# EAGLE schematic uacs (EAGLE 7.1.0)

## Sheet 1 of 5: Display
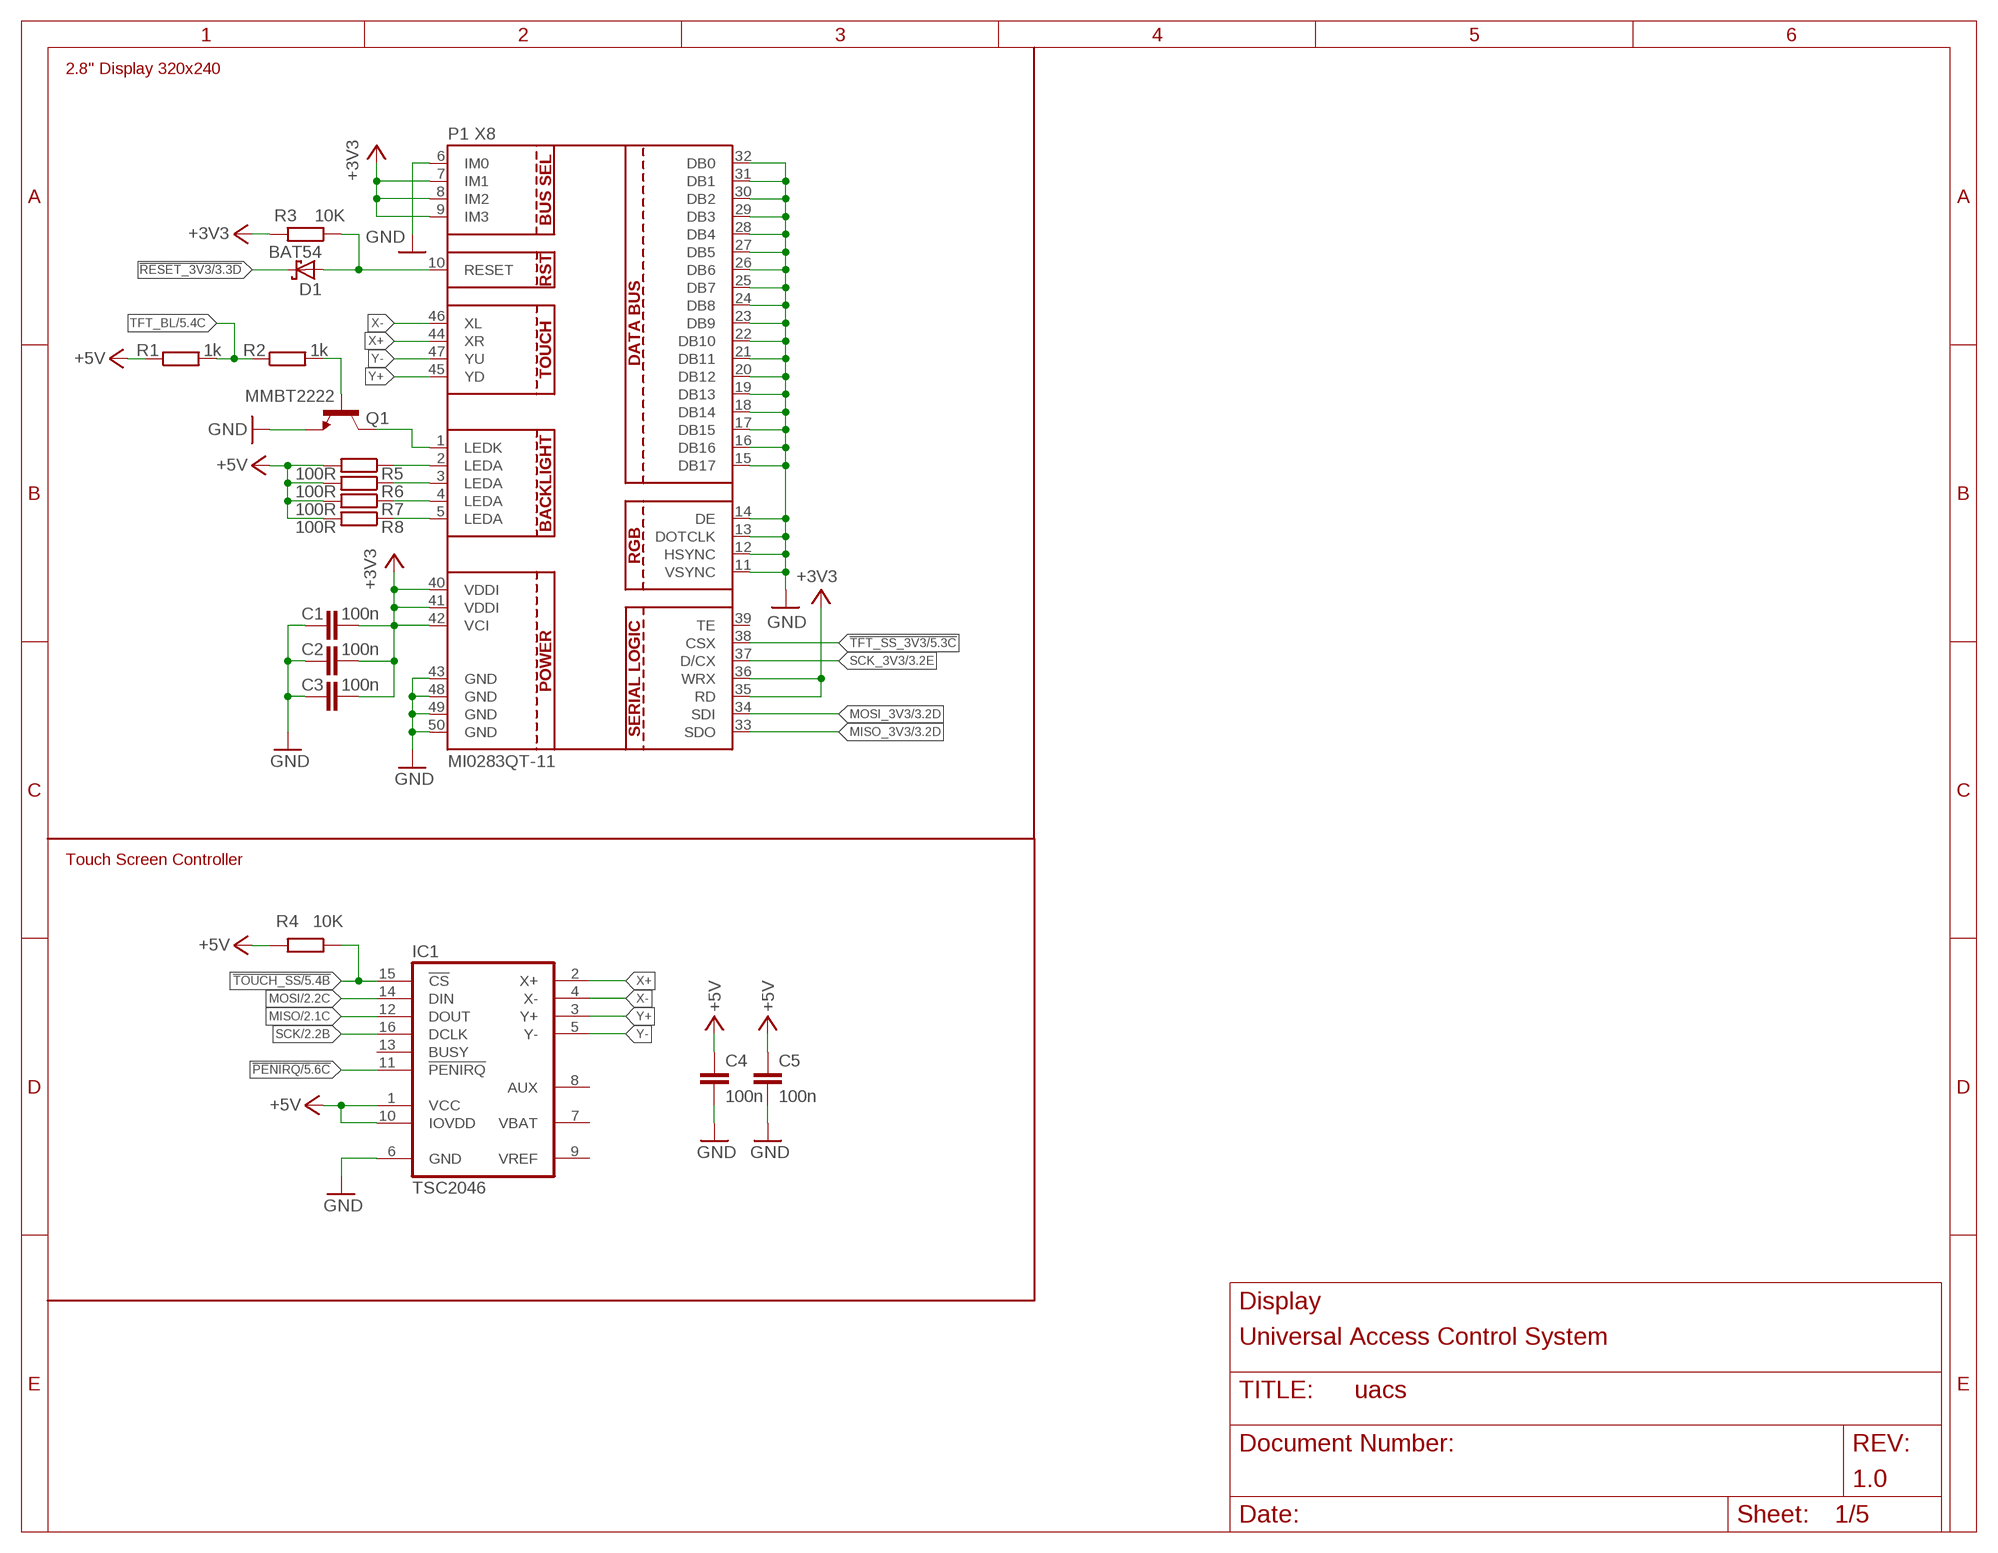
[diagram p0: schematic, sheet 1]

### Parts
C1  100n  C-EUC0603  [C0603]
C2  100n  C-EUC0603  [C0603]
C3  100n  C-EUC0603  [C0603]
C4  100n  C-EUC0603  [C0603]
C5  100n  C-EUC0603  [C0603]
D1  BAT54  [SOT23]
IC1  TSC2046  [TSSOP16]
P1  MI0283QT-11  [MI0283QT-11]
Q1  MMBT2222  TRANSISTOR_NPNMMBT2222A  [SOT23-3]
R1  1k  R-EU_R0603  [R0603]
R2  1k  R-EU_R0603  [R0603]
R3  10K  R-EU_R0603  [R0603]
R4  10K  R-EU_R0603  [R0603]
R5  100R  R-EU_R0603  [R0603]
R6  100R  R-EU_R0603  [R0603]
R7  100R  R-EU_R0603  [R0603]
R8  100R  R-EU_R0603  [R0603]

### Nets
!PENIRQ: IC1.11(!PENIRQ) ; also sheet 5
!RESET_3V3: D1.3(C) ; also sheet 3,5
!TFT_SS_3V3: P1.38(CSX) ; also sheet 5
!TOUCH_SS: IC1.15(!CS) R4.1 ; also sheet 5
+3V3: C1.2 C2.2 C3.2 P1.7(IM1) P1.8(IM2) P1.9(IM3) P1.35(RD) P1.36(WRX) P1.40(VDDI) P1.41(VDDI) P1.42(VCI) R3.2 ; also sheet 3,4,5
+5V: C4.1 C5.1 IC1.1(VCC) IC1.10(IOVDD) R1.1 R4.2 R5.2 R6.2 R7.2 R8.2 ; also sheet 2,3,4,5
GND: C1.1 C2.1 C3.1 C4.2 C5.2 IC1.6(GND) P1.6(IM0) P1.11(VSYNC) P1.12(HSYNC) P1.13(DOTCLK) P1.14(DE) P1.15(DB17) P1.16(DB16) P1.17(DB15) P1.18(DB14) P1.19(DB13) P1.20(DB12) P1.21(DB11) P1.22(DB10) P1.23(DB9) P1.24(DB8) P1.25(DB7) P1.26(DB6) P1.27(DB5) P1.28(DB4) P1.29(DB3) P1.30(DB2) P1.31(DB1) P1.32(DB0) P1.43(GND) P1.48(GND) P1.49(GND) P1.50(GND) Q1.2(E) ; also sheet 2,3,4,5
MISO: IC1.12(DOUT) ; also sheet 2,5
MISO_3V3: P1.33(SDO) ; also sheet 3,5
MOSI: IC1.14(DIN) ; also sheet 2,5
MOSI_3V3: P1.34(SDI) ; also sheet 3,5
N$2: P1.1(LEDK) Q1.3(C)
N$3: P1.5(LEDA) R8.1
N$4: Q1.1(B) R2.2
N$7: P1.4(LEDA) R7.1
N$8: P1.3(LEDA) R6.1
N$9: P1.2(LEDA) R5.1
N$58: D1.1(A) P1.10(RESET) R3.1
SCK: IC1.16(DCLK) ; also sheet 2,5
SCK_3V3: P1.37(D/CX) ; also sheet 3,5
TFT_BL: R1.2 R2.1 ; also sheet 5
X+: IC1.2(X+) P1.44(XR)
X-: IC1.4(X-) P1.46(XL)
Y+: IC1.3(Y+) P1.45(YD)
Y-: IC1.5(Y-) P1.47(YU)
Unconnected: IC1.7(VBAT) IC1.8(AUX) IC1.9(VREF) IC1.13(BUSY) P1.39(TE)

### Notes on the sheet
- 2.8" Display 320x240
- X8
- Touch Screen Controller
- Display
- Universal Access Control System
- 1.0

## Sheet 2 of 5: RFID
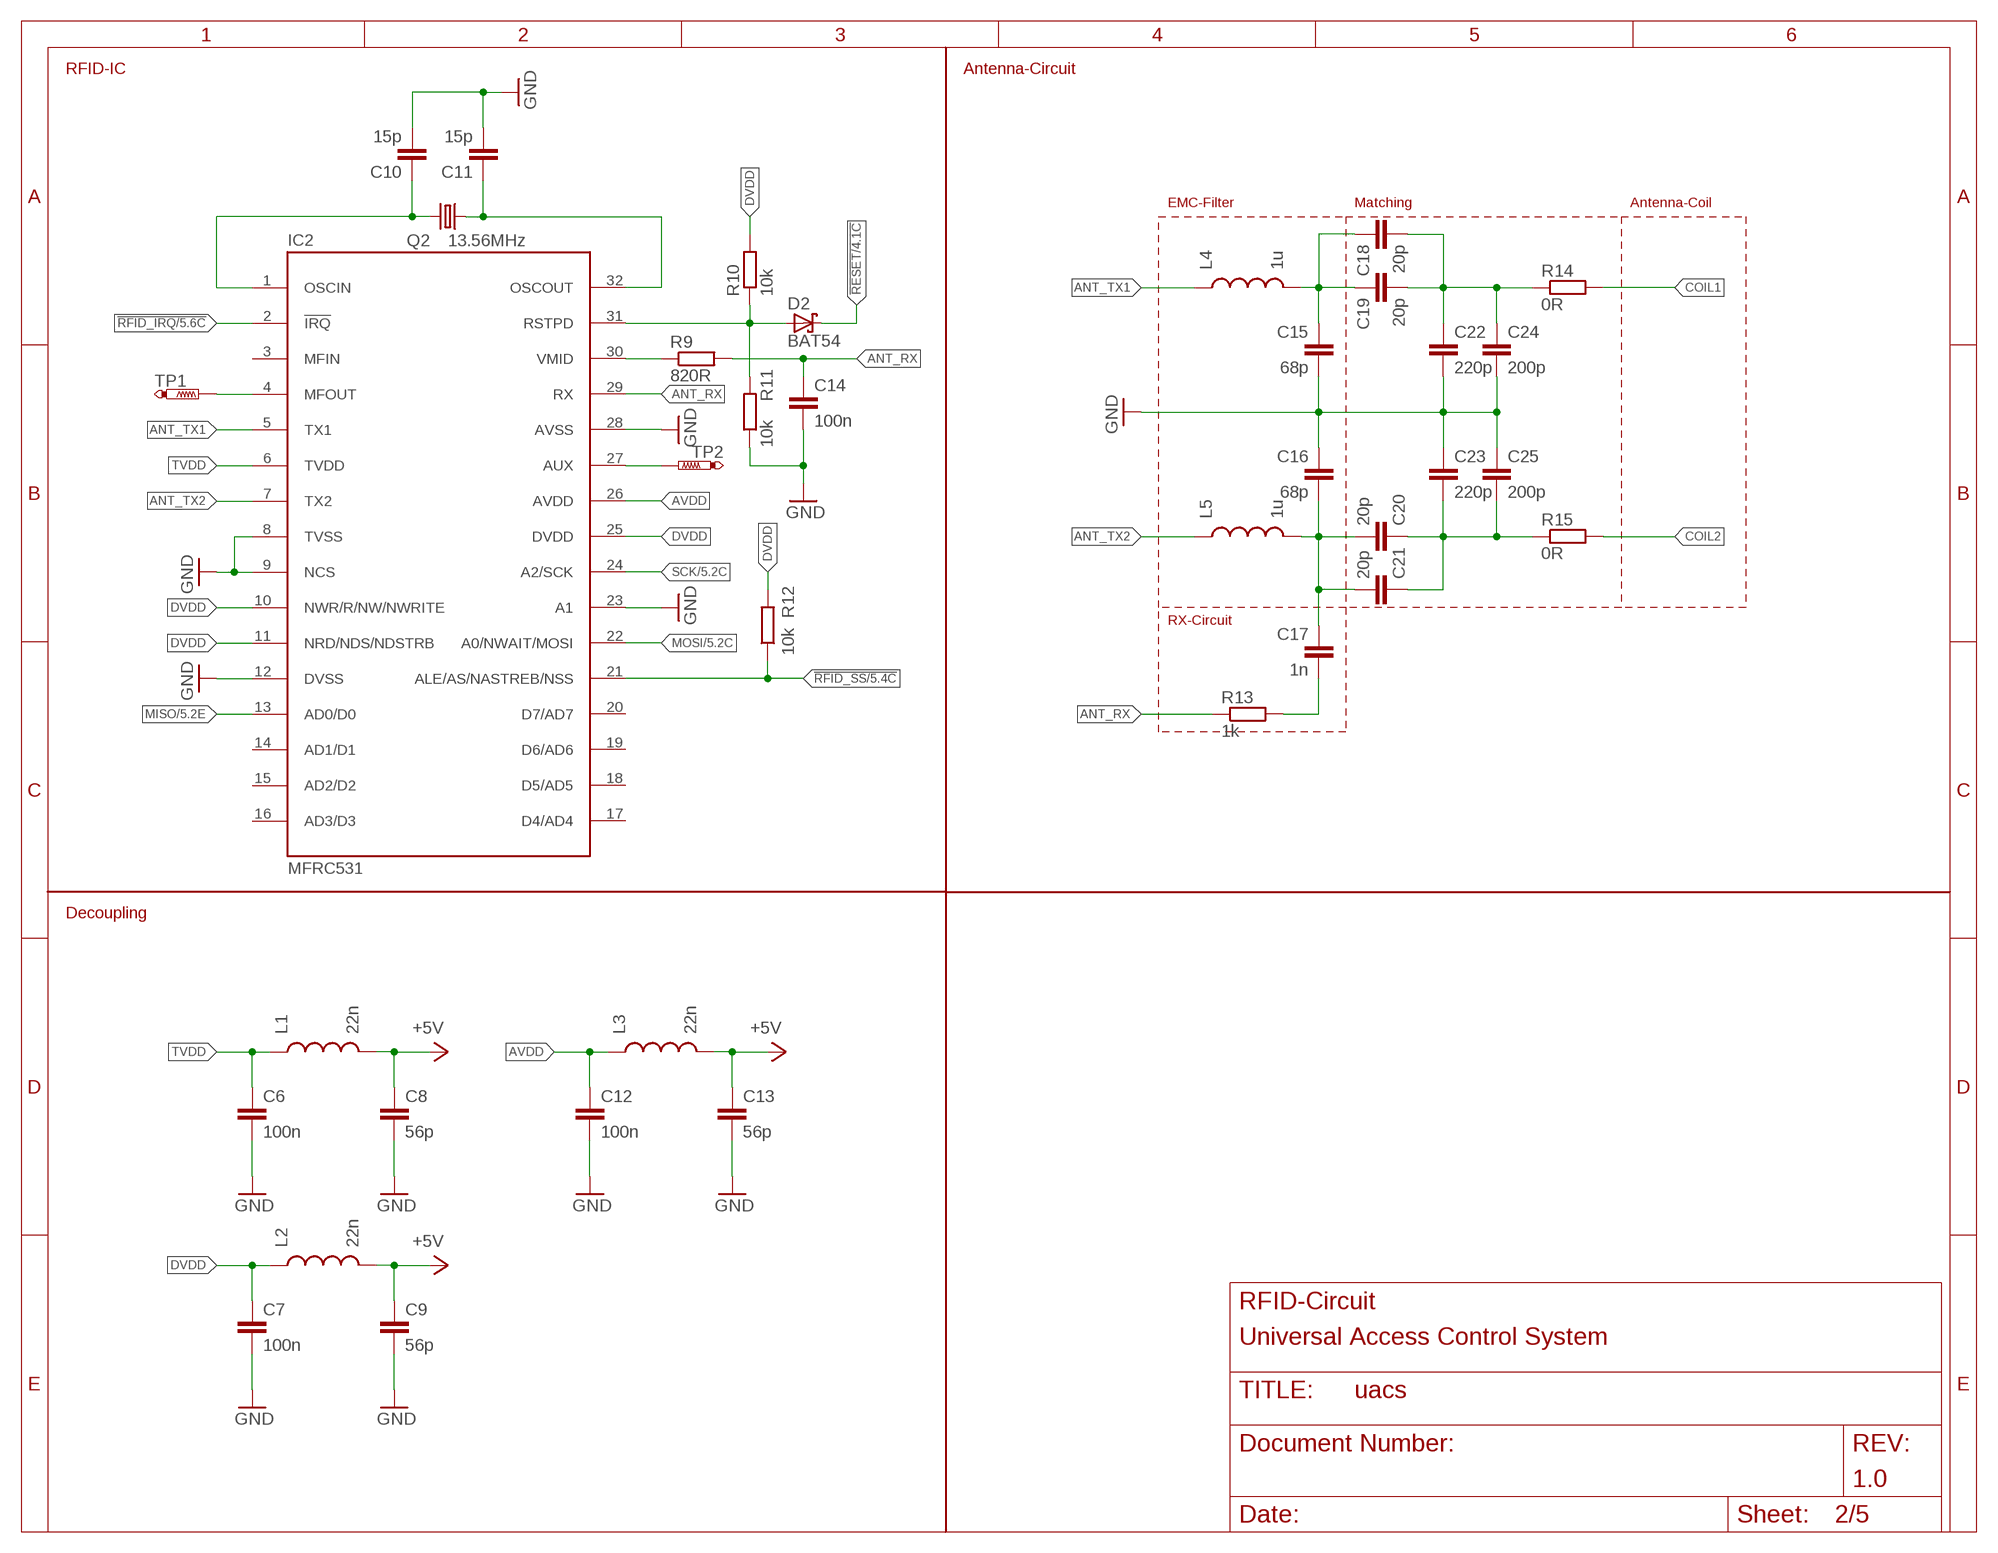
[diagram p1: schematic, sheet 2]

### Parts
C6  100n  C-EUC0603  [C0603]
C7  100n  C-EUC0603  [C0603]
C8  56p  C-EUC0603  [C0603]
C9  56p  C-EUC0603  [C0603]
C10  15p  C-EUC0603  [C0603]
C11  15p  C-EUC0603  [C0603]
C12  100n  C-EUC0603  [C0603]
C13  56p  C-EUC0603  [C0603]
C14  100n  C-EUC0603  [C0603]
C15  68p  C-EUC0603  [C0603]
C16  68p  C-EUC0603  [C0603]
C17  1n  C-EUC0603  [C0603]
C18  20p  C-EUC0603  [C0603]
C19  20p  C-EUC0603  [C0603]
C20  20p  C-EUC0603  [C0603]
C21  20p  C-EUC0603  [C0603]
C22  220p  C-EUC0603  [C0603]
C23  220p  C-EUC0603  [C0603]
C24  200p  C-EUC0603  [C0603]
C25  200p  C-EUC0603  [C0603]
D2  BAT54  [SOT23]
IC2  MFRC531  [SO32]
L1  22n  INDUCTOR0603  [0603]
L2  22n  INDUCTOR0603  [0603]
L3  22n  INDUCTOR0603  [0603]
L4  1u  INDUCTOR0603  [0603]
L5  1u  INDUCTOR0603  [0603]
Q2  13.56MHz  CRYSTALSM49  [SM49]
R9  820R  R-EU_R0603  [R0603]
R10  10k  R-EU_R0603  [R0603]
R11  10k  R-EU_R0603  [R0603]
R12  10k  R-EU_R0603  [R0603]
R13  1k  R-EU_R0603  [R0603]
R14  0R  R-EU_R0603  [R0603]
R15  0R  R-EU_R0603  [R0603]
TP1  PTR1B1,27  [B1,27]
TP2  PTR1B1,27  [B1,27]

### Nets
!RESET: D2.3(C) ; also sheet 4,5
!RFID_IRQ: IC2.2(!IRQ) ; also sheet 5
!RFID_SS: IC2.21(ALE/AS/NASTREB/NSS) R12.1 ; also sheet 5
+5V: C8.1 C9.1 C13.1 L1.2 L2.2 L3.2 ; also sheet 1,3,4,5
ANT_RX: C14.1 IC2.29(RX) R9.2 R13.1
ANT_TX1: IC2.5(TX1) L4.1
ANT_TX2: IC2.7(TX2) L5.1
AVDD: C12.1 IC2.26(AVDD) L3.1
COIL1: R14.2
COIL2: R15.2
DVDD: C7.1 IC2.10(NWR/R/NW/NWRITE) IC2.11(NRD/NDS/NDSTRB) IC2.25(DVDD) L2.1 R10.2 R12.2
GND: C6.2 C7.2 C8.2 C9.2 C10.2 C11.2 C12.2 C13.2 C14.2 C15.2 C16.1 C22.2 C23.1 C24.2 C25.1 IC2.8(TVSS) IC2.9(NCS) IC2.12(DVSS) IC2.23(A1) IC2.28(AVSS) R11.1 ; also sheet 1,3,4,5
MISO: IC2.13(AD0/D0) ; also sheet 1,5
MOSI: IC2.22(A0/NWAIT/MOSI) ; also sheet 1,5
N$1: D2.1(A) IC2.31(RSTPD) R10.1 R11.2
N$31: C11.1 IC2.32(OSCOUT) Q2.1
N$33: IC2.4(MFOUT) TP1.TP
N$34: IC2.30(VMID) R9.1
N$35: IC2.27(AUX) TP2.TP
N$36: C16.2 C17.1 C20.2 C21.2 L5.2
N$37: C17.2 R13.2
N$38: C15.1 C18.1 C19.1 L4.2
N$39: C18.2 C19.2 C22.1 C24.1 R14.1
N$43: C20.1 C21.1 C23.2 C25.2 R15.1
N$54: C10.1 IC2.1(OSCIN) Q2.2
SCK: IC2.24(A2/SCK) ; also sheet 1,5
TVDD: C6.1 IC2.6(TVDD) L1.1
Unconnected: IC2.3(MFIN) IC2.14(AD1/D1) IC2.15(AD2/D2) IC2.16(AD3/D3) IC2.17(D4/AD4) IC2.18(D5/AD5) IC2.19(D6/AD6) IC2.20(D7/AD7)

### Notes on the sheet
- RFID-IC | Antenna-Circuit
- EMC-Filter | Matching | Antenna-Coil
- RX-Circuit
- Decoupling
- RFID-Circuit
- Universal Access Control System
- 1.0

## Sheet 3 of 5: Ethernet
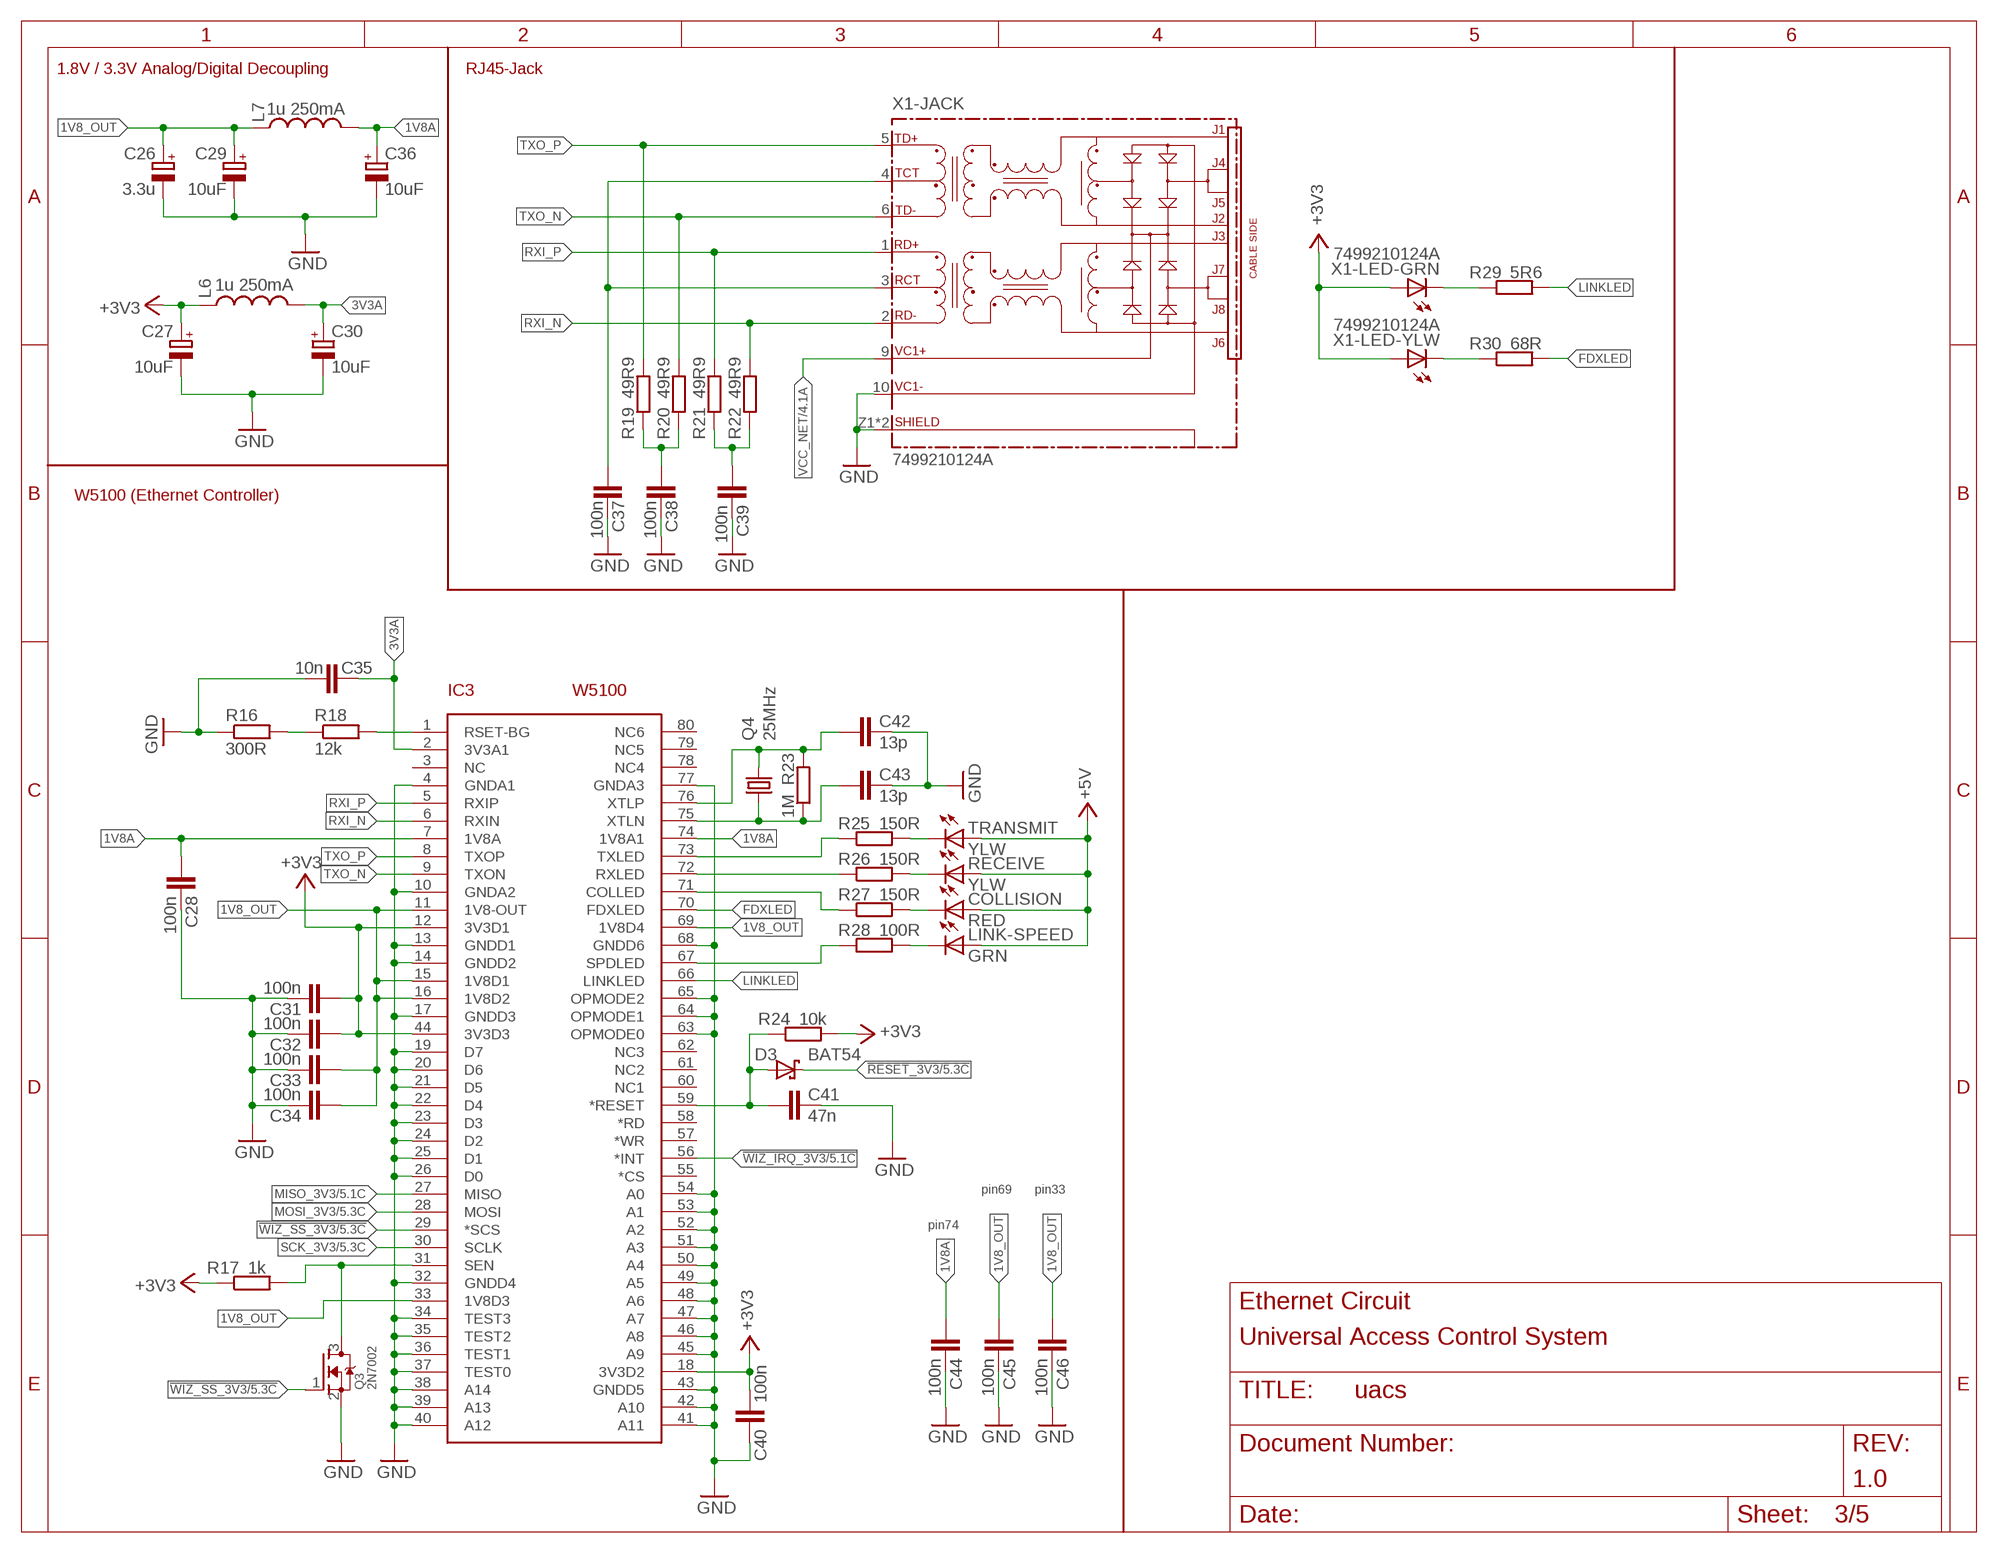
[diagram p2: schematic, sheet 3]

### Parts
C26  3.3u  CPOL-EUB/3528-21R  [B/3528-21R]
C27  10uF  CPOL-EUB/3528-21R  [B/3528-21R]
C28  100n  C-EUC0603  [C0603]
C29  10uF  CPOL-EUB/3528-21R  [B/3528-21R]
C30  10uF  CPOL-EUB/3528-21R  [B/3528-21R]
C31  100n  C-EUC0603  [C0603]
C32  100n  C-EUC0603  [C0603]
C33  100n  C-EUC0603  [C0603]
C34  100n  C-EUC0603  [C0603]
C35  10n  C-EUC0603  [C0603]
C36  10uF  CPOL-EUB/3528-21R  [B/3528-21R]
C37  100n  C-EUC0603  [C0603]
C38  100n  C-EUC0603  [C0603]
C39  100n  C-EUC0603  [C0603]
C40  100n  C-EUC0603  [C0603]
C41  47n  C-EUC0603  [C0603]
C42  13p  C-EUC0603  [C0603]
C43  13p  C-EUC0603  [C0603]
C44  100n  C-EUC0603  [C0603]
C45  100n  C-EUC0603  [C0603]
C46  100n  C-EUC0603  [C0603]
COLLISION  RED  LEDCHIPLED_0603  [CHIPLED_0603]
D3  BAT54  [SOT23]
IC3  W5100  [SQFP-S-10X10-80]
L6  1u 250mA  INDUCTOR0603  [0603]
L7  1u 250mA  INDUCTOR0603  [0603]
LINK-SPEED  GRN  LEDCHIPLED_0603  [CHIPLED_0603]
Q3  2N7002  MOSFET-NREFLOW  [SOT23]
Q4  25MHz  CRYSTALSM49  [SM49]
R16  300R  R-EU_R0603  [R0603]
R17  1k  R-EU_R0603  [R0603]
R18  12k  R-EU_R0603  [R0603]
R19  49R9  R-EU_R0603  [R0603]
R20  49R9  R-EU_R0603  [R0603]
R21  49R9  R-EU_R0603  [R0603]
R22  49R9  R-EU_R0603  [R0603]
R23  1M  R-EU_R0603  [R0603]
R24  10k  R-EU_R0603  [R0603]
R25  150R  R-EU_R0603  [R0603]
R26  150R  R-EU_R0603  [R0603]
R27  150R  R-EU_R0603  [R0603]
R28  100R  R-EU_R0603  [R0603]
R29  5R6  R-EU_R0603  [R0603]
R30  68R  R-EU_R0603  [R0603]
RECEIVE  YLW  LEDCHIPLED_0603  [CHIPLED_0603]
TRANSMIT  YLW  LEDCHIPLED_0603  [CHIPLED_0603]
X1  7499210124A  [7499210124A]

### Nets
1V8_OUT: C26.+ C29.+ C33.1 C34.1 C45.1 C46.1 IC3.11(1V8-OUT) IC3.15(1V8D1) IC3.16(1V8D2) IC3.33(1V8D3) IC3.69(1V8D4) L7.1
1V8A: C28.1 C36.+ C44.1 IC3.7(1V8A) IC3.74(1V8A1) L7.2
3V3A: C30.+ C35.1 IC3.2(3V3A1) L6.2
!RESET_3V3: D3.3(C) ; also sheet 1,5
!WIZ_IRQ_3V3: IC3.56(*INT) ; also sheet 5
!WIZ_SS_3V3: IC3.29(*SCS) Q3.1(G) ; also sheet 5
+3V3: C27.+ C31.1 C32.1 C40.1 IC3.12(3V3D1) IC3.18(3V3D2) IC3.44(3V3D3) L6.1 R17.1 R24.2 X1.12(-LED-GRN:A) X1.14(-LED-YLW:A) ; also sheet 1,4,5
+5V: COLLISION.A LINK-SPEED.A RECEIVE.A TRANSMIT.A ; also sheet 1,2,4,5
FDXLED: IC3.70(FDXLED) R30.2
GND: C26.- C27.- C28.2 C29.- C30.- C31.2 C32.2 C33.2 C34.2 C35.2 C36.- C37.2 C38.2 C39.2 C40.2 C41.2 C42.2 C43.2 C44.2 C45.2 C46.2 IC3.4(GNDA1) IC3.10(GNDA2) IC3.13(GNDD1) IC3.14(GNDD2) IC3.17(GNDD3) IC3.19(D7) IC3.20(D6) IC3.21(D5) IC3.22(D4) IC3.23(D3) IC3.24(D2) IC3.25(D1) IC3.26(D0) IC3.32(GNDD4) IC3.34(TEST3) IC3.35(TEST2) IC3.36(TEST1) IC3.37(TEST0) IC3.38(A14) IC3.39(A13) IC3.40(A12) IC3.41(A11) IC3.42(A10) IC3.43(GNDD5) IC3.45(A9) IC3.46(A8) IC3.47(A7) IC3.48(A6) IC3.49(A5) IC3.50(A4) IC3.51(A3) IC3.52(A2) IC3.53(A1) IC3.54(A0) IC3.63(OPMODE0) IC3.64(OPMODE1) IC3.65(OPMODE2) IC3.68(GNDD6) IC3.77(GNDA3) Q3.2(S) R16.1 X1.10(-JACK:VC1-) X1.Z1(-JACK:SHIELD) X1.Z2(-JACK:SHIELD) ; also sheet 1,2,4,5
LINKLED: IC3.66(LINKLED) R29.2
MISO_3V3: IC3.27(MISO) ; also sheet 1,5
MOSI_3V3: IC3.28(MOSI) ; also sheet 1,5
N$15: IC3.1(RSET-BG) R18.2
N$16: R30.1 X1.13(-LED-YLW:C)
N$17: R29.1 X1.11(-LED-GRN:C)
N$18: C41.1 D3.1(A) IC3.59(*RESET) R24.1
N$19: C39.1 R21.1 R22.1
N$20: R25.2 TRANSMIT.C
N$21: C38.1 R19.1 R20.1
N$22: IC3.67(SPDLED) R28.1
N$23: R26.2 RECEIVE.C
N$24: IC3.71(COLLED) R27.1
N$25: IC3.72(RXLED) R26.1
N$26: IC3.73(TXLED) R25.1
N$27: COLLISION.C R27.2
N$28: LINK-SPEED.C R28.2
N$29: C43.1 IC3.75(XTLN) Q4.1 R23.1
N$30: C42.1 IC3.76(XTLP) Q4.2 R23.2
N$44: R16.2 R18.1
RXI_N: IC3.6(RXIN) R22.2 X1.2(-JACK:RD-)
RXI_P: IC3.5(RXIP) R21.2 X1.1(-JACK:RD+)
SCK_3V3: IC3.30(SCLK) ; also sheet 1,5
SEN: IC3.31(SEN) Q3.3(D) R17.2
TXCT: C37.1 X1.3(-JACK:RCT) X1.4(-JACK:TCT)
TXO_N: IC3.9(TXON) R20.2 X1.6(-JACK:TD-)
TXO_P: IC3.8(TXOP) R19.2 X1.5(-JACK:TD+)
VCC_NET: X1.9(-JACK:VC1+) ; also sheet 4
Unconnected: IC3.3(NC) IC3.55(*CS) IC3.57(*WR) IC3.58(*RD) IC3.60(NC1) IC3.61(NC2) IC3.62(NC3) IC3.78(NC4) IC3.79(NC5) IC3.80(NC6)

### Notes on the sheet
- 1.8V / 3.3V Analog/Digital Decoupling | RJ45-Jack
- W5100 (Ethernet Controller)
- pin69 | pin33
- pin74
- Ethernet Circuit
- Universal Access Control System
- 1.0

## Sheet 4 of 5: Power
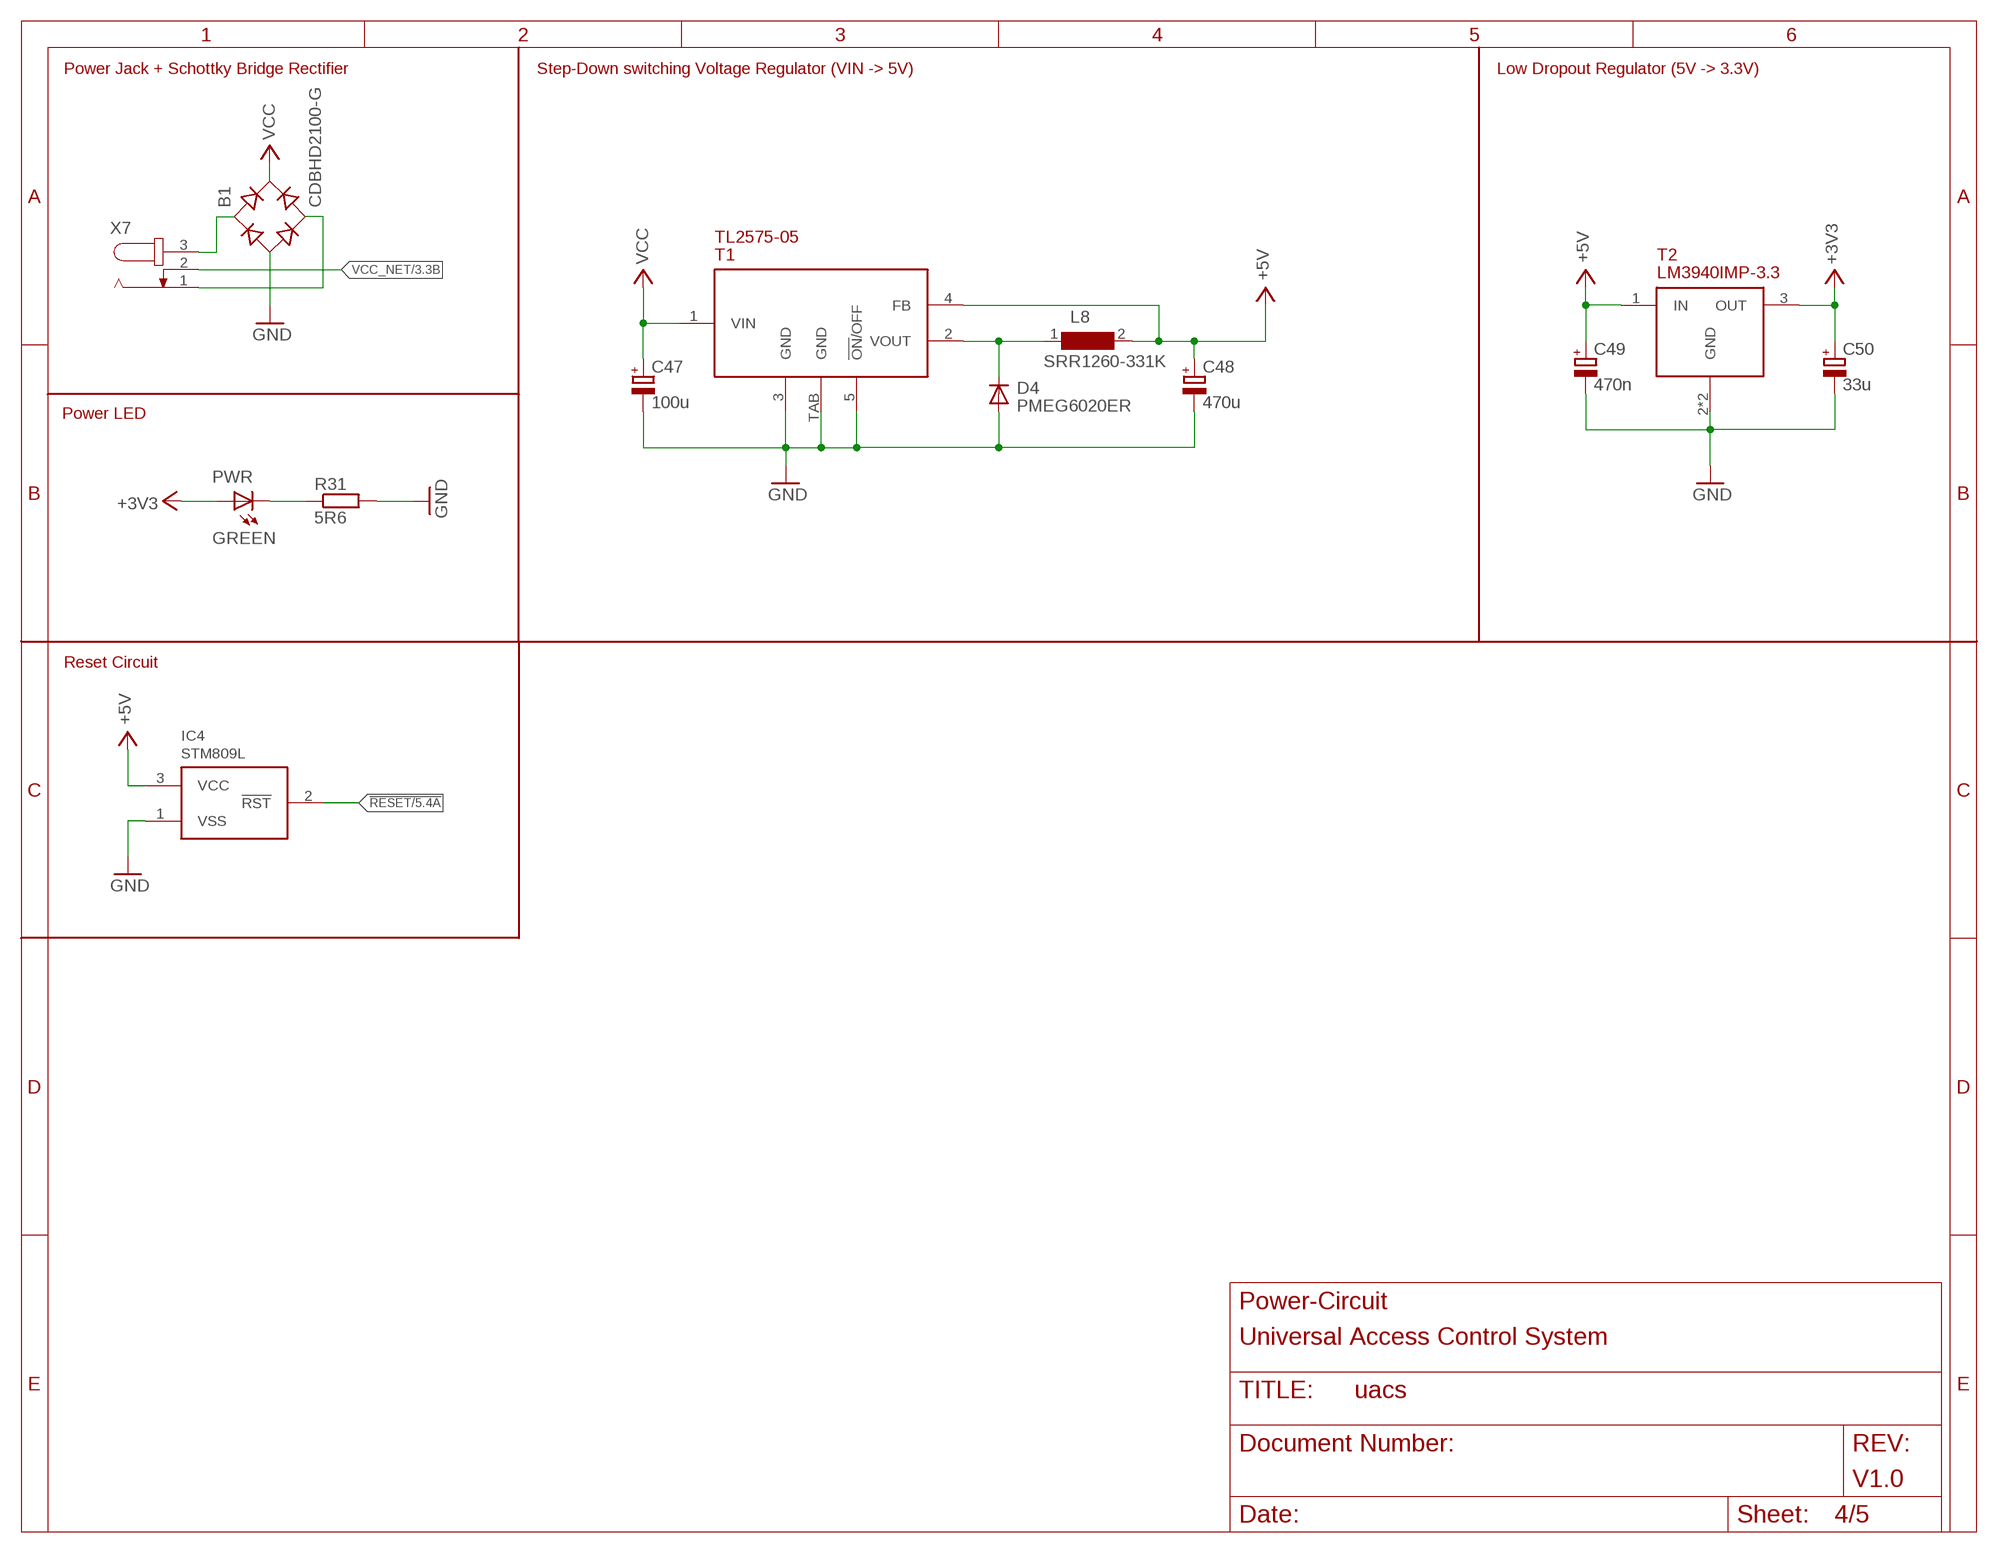
[diagram p3: schematic, sheet 4]

### Parts
B1  CDBHD2100-G  B10S  [MBS]
C47  100u  CPOL-EUG  [PANASONIC_G]
C48  470u  CPOL-EUG  [PANASONIC_G]
C49  470n  CPOL-EUB  [PANASONIC_B]
C50  33u  CPOL-EUD  [PANASONIC_D]
D4  PMEG6020ER  DIODESOD-123  [SOD-123]
IC4  STM809L  STM809  [SOT-23-3]
L8  SRR1260-331K  WE-PD_1260/1245/1280/1210  [WE-PD_1260/1245/1280/1210]
PWR  GREEN  LEDCHIPLED_0603  [CHIPLED_0603]
R31  5R6  R-EU_R0603  [R0603]
T1  TL2575-05  [TO-263-5]
T2  LM3940IMP-3.3  [SOT223]
X7  JACK-PLUG1  [SPC4078]

### Nets
!RESET: IC4.2(!RST) ; also sheet 2,5
+3V3: C50.+ PWR.A T2.3(OUT) ; also sheet 1,3,5
+5V: C48.+ C49.+ IC4.3(VCC) L8.2 T1.4(FB) T2.1(IN) ; also sheet 1,2,3,5
GND: B1.- C47.- C48.- C49.- C50.- D4.A IC4.1(VSS) R31.2 T1.3(GND) T1.5(!ON!/OFF) T1.TAB(GND) T2.2(GND) T2.4(GND) ; also sheet 1,2,3,5
N$42: PWR.C R31.1
N$45: B1.AC1 X7.3
N$46: B1.AC2 X7.1
N$48: D4.C L8.1 T1.2(VOUT)
VCC: B1.+ C47.+ T1.1(VIN)
VCC_NET: X7.2 ; also sheet 3

### Notes on the sheet
- Power Jack + Schottky Bridge Rectifier | Step-Down switching Voltage Regulator (VIN -> 5V) | Low Dropout Regulator (5V -> 3.3V)
- Power LED
- Reset Circuit
- Power-Circuit
- Universal Access Control System
- V1.0

## Sheet 5 of 5: MCU
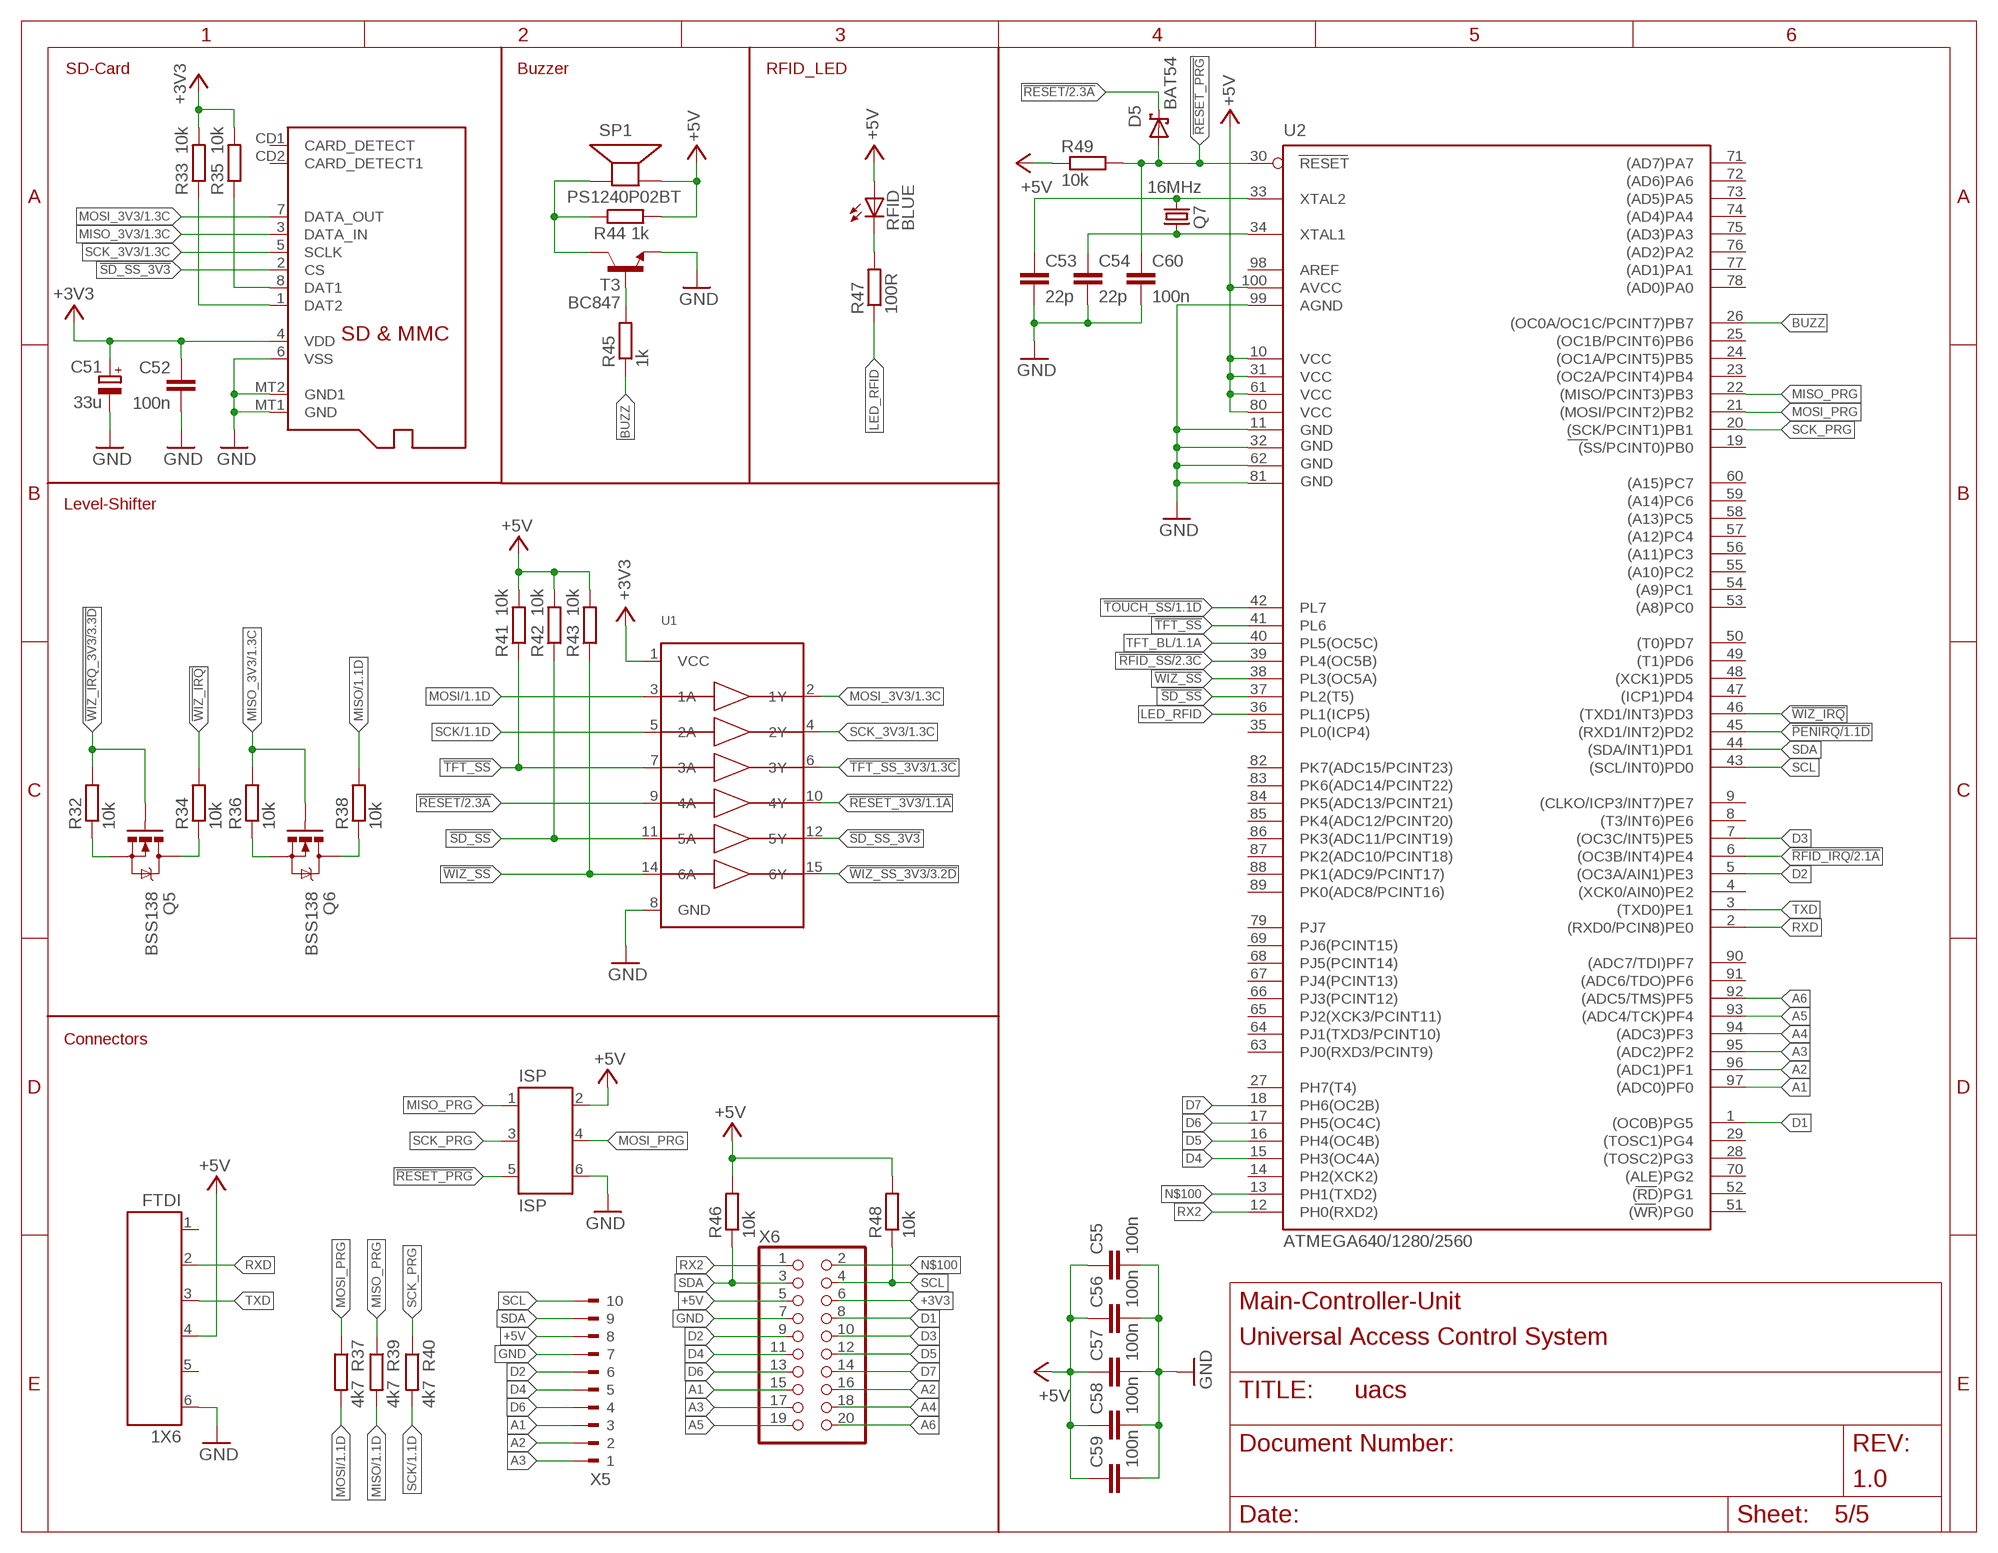
[diagram p4: schematic, sheet 5]

### Parts
C51  33u  CPOL-EUC/6032-28R  [C/6032-28R]
C52  100n  C-EUC0603  [C0603]
C53  22p  C-EUC0603  [C0603]
C54  22p  C-EUC0603  [C0603]
C55  100n  C-EUC0603  [C0603]
C56  100n  C-EUC0603  [C0603]
C57  100n  C-EUC0603  [C0603]
C58  100n  C-EUC0603  [C0603]
C59  100n  C-EUC0603  [C0603]
C60  100n  C-EUC0603  [C0603]
D5  BAT54  [SOT23]
FTDI  1X6  [1X6]
ISP  ISP  2X3  [2X3]
Q5  BSS138  MOSFET-NCHANNELBSS138  [SOT23]
Q6  BSS138  MOSFET-NCHANNELBSS138  [SOT23]
Q7  16MHz  CRYSTALSM49  [SM49]
R32  10k  R-EU_R0603  [R0603]
R33  10k  R-EU_R0603  [R0603]
R34  10k  R-EU_R0603  [R0603]
R35  10k  R-EU_R0603  [R0603]
R36  10k  R-EU_R0603  [R0603]
R37  4k7  R-EU_R0603  [R0603]
R38  10k  R-EU_R0603  [R0603]
R39  4k7  R-EU_R0603  [R0603]
R40  4k7  R-EU_R0603  [R0603]
R41  10k  R-EU_R0603  [R0603]
R42  10k  R-EU_R0603  [R0603]
R43  10k  R-EU_R0603  [R0603]
R44  1k  R-EU_R0603  [R0603]
R45  1k  R-EU_R0603  [R0603]
R46  10k  R-EU_R0603  [R0603]
R47  100R  R-EU_R0603  [R0603]
R48  10k  R-EU_R0603  [R0603]
R49  10k  R-EU_R0603  [R0603]
RFID  BLUE  LEDCHIPLED_0603  [CHIPLED_0603]
SP1  PS1240P02BT  SPEAKER/PS12  [PS12]
T3  BC847  [SOT23]
U1  74HC4050DTSSOP  [TSSOP16]
U2  ATMEGA640/1280/2560  ATMEGA2560AU  [TQFP100]
X3  MICROSD  [MICROSD]
X5  180-10  [180-10]
X6  PINHD-2X10  [2X10]

### Nets
!PENIRQ: U2.45((RXD1/INT2)PD2) ; also sheet 1
!RESET: D5.3(C) U1.9(4A) ; also sheet 2,4
!RESET_3V3: U1.10(4Y) ; also sheet 1,3
!RESET_PRG: C60.1 D5.1(A) ISP.5 R49.2 U2.30(RESET)
!RFID_IRQ: U2.6((OC3B/INT4)PE4) ; also sheet 2
!RFID_SS: U2.39(PL4(OC5B)) ; also sheet 2
!SD_SS: R42.1 U1.11(5A) U2.37(PL2(T5))
!SD_SS_3V3: U1.12(5Y) X3.2(CS)
!TFT_SS: R41.1 U1.7(3A) U2.41(PL6)
!TFT_SS_3V3: U1.6(3Y) ; also sheet 1
!TOUCH_SS: U2.42(PL7) ; also sheet 1
!WIZ_IRQ: R34.2 U2.46((TXD1/INT3)PD3)
!WIZ_IRQ_3V3: Q5.1(G) R32.2 ; also sheet 3
!WIZ_SS: R43.1 U1.14(6A) U2.38(PL3(OC5A))
!WIZ_SS_3V3: U1.15(6Y) ; also sheet 3
+3V3: C51.+ C52.1 R33.2 R35.2 U1.1(VCC) X3.4(VDD) X6.6 ; also sheet 1,3,4
+5V: C55.1 C56.1 C57.1 C58.1 C59.1 FTDI.4 ISP.2 R41.2 R42.2 R43.2 R44.2 R46.2 R48.2 R49.1 RFID.A SP1.P$2(-) U2.10(VCC) U2.31(VCC1) U2.61(VCC2) U2.80(VCC3) U2.100(AVCC) X5.8 X6.5 ; also sheet 1,2,3,4
A1: U2.97((ADC0)PF0) X5.3 X6.15
A2: U2.96((ADC1)PF1) X5.2 X6.16
A3: U2.95((ADC2)PF2) X5.1 X6.17
A4: U2.94((ADC3)PF3) X6.18
A5: U2.93((ADC4/TCK)PF4) X6.19
A6: U2.92((ADC5/TMS)PF5) X6.20
BUZZ: R45.1 U2.26((OC0A/OC1C/PCINT7)PB7)
D1: U2.1((OC0B)PG5) X6.8
D2: U2.5((OC3A/AIN1)PE3) X5.6 X6.9
D3: U2.7((OC3C/INT5)PE5) X6.10
D4: U2.15(PH3(OC4A)) X5.5 X6.11
D5: U2.16(PH4(OC4B)) X6.12
D6: U2.17(PH5(OC4C)) X5.4 X6.13
D7: U2.18(PH6(OC2B)) X6.14
GND: C51.- C52.2 C53.2 C54.2 C55.2 C56.2 C57.2 C58.2 C59.2 C60.2 FTDI.6 ISP.6 T3.2(E) U1.8(GND) U2.11(GND) U2.32(GND1) U2.62(GND2) U2.81(GND3) U2.99(AGND) X3.6(VSS) X3.MT1(GND) X3.MT2(GND1) X5.7 X6.7 ; also sheet 1,2,3,4
LED_RFID: R47.1 U2.36(PL1(ICP5))
MISO: R38.2 R39.2 ; also sheet 1,2
MISO_3V3: Q6.1(G) R36.2 X3.3(DATA_IN) ; also sheet 1,3
MISO_PRG: ISP.1 R39.1 U2.22((MISO/PCINT3)PB3)
MOSI: R37.2 U1.3(1A) ; also sheet 1,2
MOSI_3V3: U1.2(1Y) X3.7(DATA_OUT) ; also sheet 1,3
MOSI_PRG: ISP.4 R37.1 U2.21((MOSI/PCINT2)PB2)
N$6: R47.2 RFID.C
N$12: C54.1 Q7.1 U2.34(XTAL1)
N$13: C53.1 Q7.2 U2.33(XTAL2)
N$14: R35.1 X3.8(DAT1)
N$40: R44.1 SP1.P$1(+) T3.3(C)
N$41: R45.2 T3.1(B)
N$47: Q6.3(D) R38.1
N$49: Q6.2(S) R36.1
N$50: Q5.2(S) R32.1
N$52: Q5.3(D) R34.1
N$53: R33.1 X3.1(DAT2)
N$100: U2.13(PH1(TXD2)) X6.2
RX2: U2.12(PH0(RXD2)) X6.1
RXD: FTDI.2 U2.2((RXD0/PCIN8)PE0)
SCK: R40.2 U1.5(2A) ; also sheet 1,2
SCK_3V3: U1.4(2Y) X3.5(SCLK) ; also sheet 1,3
SCK_PRG: ISP.3 R40.1 U2.20((SCK/PCINT1)PB1)
SCL: R48.1 U2.43((SCL/INT0)PD0) X5.10 X6.4
SDA: R46.1 U2.44((SDA/INT1)PD1) X5.9 X6.3
TFT_BL: U2.40(PL5(OC5C)) ; also sheet 1
TXD: FTDI.3 U2.3((TXD0)PE1)
Unconnected: FTDI.1 FTDI.5 U2.4((XCK0/AIN0)PE2) U2.8((T3/INT6)PE6) U2.9((CLKO/ICP3/INT7)PE7) U2.14(PH2(XCK2)) U2.19((SS/PCINT0)PB0) U2.23((OC2A/PCINT4)PB4) U2.24((OC1A/PCINT5)PB5) U2.25((OC1B/PCINT6)PB6) U2.27(PH7(T4)) U2.28((TOSC2)PG3) U2.29((TOSC1)PG4) U2.35(PL0(ICP4)) U2.47((ICP1)PD4) U2.48((XCK1)PD5) U2.49((T1)PD6) U2.50((T0)PD7) U2.51((WR)PG0) U2.52((RD)PG1) U2.53((A8)PC0) U2.54((A9)PC1) U2.55((A10)PC2) U2.56((A11)PC3) U2.57((A12)PC4) U2.58((A13)PC5) U2.59((A14)PC6) U2.60((A15)PC7) U2.63(PJ0(RXD3/PCINT9)) U2.64(PJ1(TXD3/PCINT10)) U2.65(PJ2(XCK3/PCINT11)) U2.66(PJ3(PCINT12)) U2.67(PJ4(PCINT13)) U2.68(PJ5(PCINT14)) U2.69(PJ6(PCINT15)) U2.70((ALE)PG2) U2.71((AD7)PA7) U2.72((AD6)PA6) U2.73((AD5)PA5) U2.74((AD4)PA4) U2.75((AD3)PA3) U2.76((AD2)PA2) U2.77((AD1)PA1) U2.78((AD0)PA0) U2.79(PJ7) U2.82(PK7(ADC15/PCINT23)) U2.83(PK6(ADC14/PCINT22)) U2.84(PK5(ADC13/PCINT21)) U2.85(PK4(ADC12/PCINT20)) U2.86(PK3(ADC11/PCINT19)) U2.87(PK2(ADC10/PCINT18)) U2.88(PK1(ADC9/PCINT17)) U2.89(PK0(ADC8/PCINT16)) U2.90((ADC7/TDI)PF7) U2.91((ADC6/TDO)PF6) U2.98(AREF) X3.CD1(CARD_DETECT) X3.CD2(CARD_DETECT1)

### Notes on the sheet
- SD-Card | Buzzer | RFID_LED
- Level-Shifter
- Connectors
- Main-Controller-Unit
- Universal Access Control System
- 1.0

## Library data of the parts
B1 = rectifier:B*S: Surface Mount Glass Passivated Bridge Rectifiers Source: Comchip Bridge Rectifiers B05S-G_B10S-G.pdf
C1-C25 C28 C31-C35 C37-C46 C52-C60 = rcl:C-EU: CAPACITOR, European symbol
C26 C27 C29 C30 C36 C47-C51 = rcl:CPOL-EU: POLARIZED CAPACITOR, European symbol
COLLISION LINK-SPEED PWR RECEIVE RFID TRANSMIT = adafruit:LED: LED OSRAM: - CHIPLED LG R971, LG N971, LY N971, LG Q971, LY Q971, LO R971, LY R971 LH N974, LH R974 LS Q976, LO Q976, LY Q976 LO Q996 - Hyper CHIPLED LW Q18S LB Q993, LB Q99A, LB R99A - SideLED LS A670, LO A670, LY A670, LG A670, LP A670 LB A673, LV A673, LT A673, LW A673 LH A674 LY A675 LS A676, LA A676, LO A676, LY A676, LW A676 LS A679, LY A679, LG A679 - Hyper Micro SIDELED® LS Y876, LA Y876, LO Y876, LY Y876 LT Y87S - SmartLED LW L88C, LW L88S LB L89C, LB L89S, LG L890 LS L89K, LO L89K, LY L89K LS L896, LA L896, LO L896, LY L896 - TOPLED LS T670, LO T670, LY T670, LG T670, LP T670 LSG T670, LSP T670, LSY T670, LOP T670, LYG T670 LG T671, LOG T671, LSG T671 LB T673, LV T673, LT T673, LW T673 LH T674 LS T676, LA T676, LO T676, LY T676, LB T676, LH T676, LSB T676, LW T676 LB T67C, LV T67C, LT T67C, LS T67K, LO T67K, LY T67K, LW E67C LS E67B, LA E67B, LO E67B, LY E67B, LB E67C, LV E67C, LT E67C LW T67C LS T679, LY T679, LG T679 LS T770, LO T770, LY T770, LG T770, LP T770 LB T773, LV T773, LT T773, LW T773 LH T774 LS E675, LA E675, LY E675, LS T675 LS T776, LA T776, LO T776, LY T776, LB T776 LHGB T686 LT T68C, LB T68C - Hyper Mini TOPLED® LB M676 - Mini TOPLED Santana® LG M470 LS M47K, LO M47K, LY M47K Source: http://www.osram.convergy.de/
D1-D3 D5 = diode:BAT54: Schottky Diodes Source: Fairchild .. BAT54.pdf
D4 = adafruit:DIODE: Diode SMADIODE - SMA Surface Mount Package 20V 1A Schottky Diode Digikey: 641-1014-6-ND DO-1N4148 - Through Hole Small Current Diode SOD-123 20V 1 A (.5mV Vf) Schottky Diode - Digikey: MBRX120TPMSCT-ND SOD-323 10V 570mA (.38mV Vf, 3ns) Schottky Diode - Digikey: ZLLS410CT-ND SOD-523 30V 30mA Schottky Diode (RB751S-40TE61) - Digikey: RB751S-40TE61CT-ND SOT23-R/W - SOT23 Package (R = Solder Paste/Reflow Ovens, W = Hand-Soldering) BAT54Film 40V 300mA - Digikey: 497-7162-1-ND
FTDI = pinheader-smd:1X6
IC1 = TSC2046:TSC2046: ADS7846 Touch Screen Controller
IC2 = mfrc531:MFRC531: MFRC531 Standard ISO/IEC 14443 A/B reader solution
IC3 = SmartPrj:W5100
IC4 = stm809:STM809: STM809 Reset circuit Datasheet: http://www.st.com/web/en/resource/technical/document/datasheet/CD00003591.pdf; MOUSER: 511-STM809TWX6F
ISP = pinheader-smd:2X3
L1-L7 = SparkFun-Passives:INDUCTOR: Inductors Basic Inductor/Choke - 0603 and 1206. Footprints are not proven and vary greatly between part numbers. SRN6045- 33uH, 20% 1.4A SDR0403-560KL - 56uH, 10%, 500mA RMS/740mA peak
L8 = EagleLibrary_Wuerth_Elektronik_eiSos_V6_20140807:WE-PD: SMD-Shielded Power Inductors WE-PD - Magnetically shielded version which results in a low leakage field - High storage capacity - Low self-losses - Highest possible current loading for SMD-Inducors -- Switching regulators with low operating voltages (computer, laptop, mobile phones, pagers) -- Integrated DC/DC-converter -- Is recommended for the application with switching regulators from National Semiconductor, Linear Technology, Texas Instruments and Fairchild Semiconductor, ect. -- Graphic cards -- Plastic base: Because of the one piece construction these are more suitable for high vibration or shock applications <http://katalog.we-online.de/media/images/eisos/FePBF_pf2.jpg> Details see: http://katalog.we-online.de/en/pbs/WE-PD? Updated by Dan Xu 2014-07-08 2014 (C) Würth Elektronik
P1 = MI0283QT-11:MI0283QT-11: LCD MODULE SPECIFICATION Model : MI0283QT-11
Q1 = SparkFun-DiscreteSemi:TRANSISTOR_NPN: Generic NPN BJT MMBT2222A - TRANS-08049 (SOT-23, 1A 40V) MPSA42 - TRANS-09116 (SOT-23, 500mA 300V) MMBT5088LT1G - TRANS-11160 (SOT-23, 50 mA 30V); PROD_ID: TRANS-08049; VALUE: MMBT2222A
Q2 Q4 Q7 = adafruit:CRYSTAL: CRYSTAL; OC_FARNELL: unknown; OC_NEWARK: unknown
Q3 = adafruit:MOSFET-N: N-Channel Mosfet 2N7002E - 60V 260mA SOT23 [Digikey: 2N7002ET1GOSTR-ND] - REEL BSH103 - 30V 850mA SOT23 [Digikey: 568-5013-1-ND]
Q5 Q6 = SparkFun-DiscreteSemi:MOSFET-NCHANNEL: Common NMOSFET Parts MFG P/N Store ID Prod ID FDD8780 TRANS-09984 SI7820DN TRANS-11055 FDS6630A IC-08089 2N7002PW TRANS-11151 FQP30N06L COM-10213 TRANS-10060 BSS123LT1G TRANS-08345 BSS138 TRANS-00830 BS170 2N7000; PROD_ID: TRANS-00830
R1-R49 = rcl:R-EU_: RESISTOR, European symbol
SP1 = adafruit:SPEAKER: SPEAKER Source: Buerklin Added PS12 (for part # PS1240 piezo) http://www.ladyada.net/library/pcb/eaglelibrary.html
T1 = tl2575:TL2575-05: TL2574 1-A SIMPLE STEP-DOWN SWITCHING VOLTAGE REGULATORS Datasheet: http://www.ti.com/lit/ds/symlink/tl2575-05.pdf
T2 = LM3940:LM3940IMP-3.3: 1A Low Dropout Regulator for 5V to 3.3V Conversion
T3 = transistor:BC847: NPN TRANSISTOR
TP1 TP2 = testpad:PTR1: TEST PIN
U1 = microbuilder:74HC4050D: 6-channel level shifter 74HC4050D - 2V-6V Supply SOIC16 Digikey: 74HC4050D,653-ND Mouser: 771-74HC4050D-T TSSOP16 Digikey: 296-9215-1-ND Mouser:
U2 = SparkFun-DigitalIC:ATMEGA2560: Atmel 100-pin 8-bit uC 64/128/256 Kbytes FLASH 4 Kbytes EEPROM 8 Kbytes SRAM 86 General Purpose I/O pins 12-channels16-bit PWM 4 x Serial USARTs 16-channels 10-bit A/D
X1 = 7499210124A:7499210124A: LAN-Übertrager WE-RJ45LAN 10/100BaseT PoE Wuerth 7499210124A Datasheet: http://www.mouser.com/ds/2/445/7499210124A-254273.pdf
X3 = adafruit:MICROSD: Micro-SD / Transflash card holder with SPI pinout For the 3M # 2908-05WB-MG and/or 4UCON #19656 push-push type
X5 = con-weidmueller-sl35:180-10: WEIDMUELLER CLAMP CONNECTOR; OC_FARNELL: unknown; OC_NEWARK: unknown
X6 = SparkFun-Connectors:PINHD-2X10: PIN HEADER
X7 = con-jack:JACK-PLUG: DC POWER JACK Power Jack, DC, Right Angle, Through Hole, Rated 5A at 16VDC, PC Terminals Distributor: Farnell (www.Farnell.de) Drawing: 84N1161.pdf / 84N1162.pdf Manufacturer: SPC Technology (www.spctechnology.com) Type: SPC4077 / SPC 4078; OC_FARNELL: unknown; OC_NEWARK: unknown